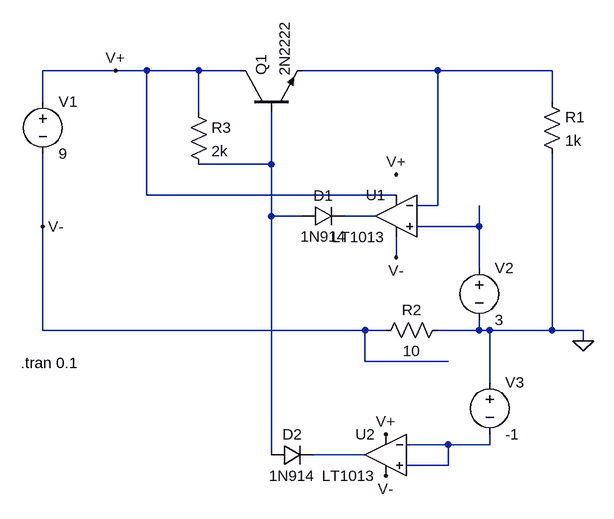
[diagram p0: schematic Draft10.asc]
Draft10.asc, the LTspice schematic file:
Version 4
SHEET 1 880 696
WIRE -144 0 -256 0
WIRE -96 0 -144 0
WIRE -16 0 -96 0
WIRE 48 0 -16 0
WIRE 352 0 144 0
WIRE 528 0 352 0
WIRE -256 48 -256 0
WIRE 528 48 528 0
WIRE -16 64 -16 0
WIRE 96 144 96 64
WIRE 96 144 -16 144
WIRE -96 192 -96 0
WIRE 288 192 -96 192
WIRE 352 208 352 0
WIRE 352 208 320 208
WIRE 96 224 96 144
WIRE 144 224 96 224
WIRE 256 224 208 224
WIRE -256 240 -256 128
WIRE 416 240 416 208
WIRE 416 240 320 240
WIRE 288 288 288 256
WIRE 416 304 416 240
WIRE -256 400 -256 240
WIRE 240 400 -256 400
WIRE 272 400 240 400
WIRE 416 400 416 384
WIRE 416 400 352 400
WIRE 432 400 416 400
WIRE 528 400 528 128
WIRE 528 400 432 400
WIRE 576 400 528 400
WIRE 576 416 576 400
WIRE 240 448 240 400
WIRE 368 448 240 448
WIRE 432 480 432 400
WIRE 368 576 304 576
WIRE 432 576 432 560
WIRE 432 576 368 576
WIRE 96 592 96 224
WIRE 240 592 160 592
WIRE 368 608 368 576
WIRE 368 608 304 608
FLAG 576 416 0
FLAG -144 0 V+
FLAG 288 160 V+
FLAG -256 240 V-
FLAG 272 560 V+
FLAG 288 288 V-
FLAG 272 624 V-
SYMBOL voltage -256 32 R0
WINDOW 123 0 0 Left 0
WINDOW 39 0 0 Left 0
SYMATTR InstName V1
SYMATTR Value 9
SYMBOL res 512 32 R0
SYMATTR InstName R1
SYMATTR Value 1k
SYMBOL res 368 384 R90
WINDOW 0 0 56 VBottom 2
WINDOW 3 32 56 VTop 2
SYMATTR InstName R2
SYMATTR Value 10
SYMBOL Opamps\\LT1013 288 160 M0
SYMATTR InstName U1
SYMBOL diode 144 240 R270
WINDOW 0 32 32 VTop 2
WINDOW 3 0 32 VBottom 2
SYMATTR InstName D1
SYMATTR Value 1N914
SYMBOL voltage 416 288 R0
WINDOW 123 0 0 Left 0
WINDOW 39 0 0 Left 0
SYMATTR InstName V2
SYMATTR Value 3
SYMBOL Opamps\\LT1013 272 528 M0
SYMATTR InstName U2
SYMBOL diode 96 608 R270
WINDOW 0 32 32 VTop 2
WINDOW 3 0 32 VBottom 2
SYMATTR InstName D2
SYMATTR Value 1N914
SYMBOL voltage 432 464 R0
WINDOW 123 0 0 Left 0
WINDOW 39 0 0 Left 0
SYMATTR InstName V3
SYMATTR Value -1
SYMBOL npn 48 64 R270
SYMATTR InstName Q1
SYMATTR Value 2N2222
SYMBOL res -32 48 R0
SYMATTR InstName R3
SYMATTR Value 2k
TEXT -290 450 Left 2 !.tran 0.1

The netlist it stands for:
* Draft10.asc
V1 V+ V- 9
R1 N001 0 1k
R2 0 V- 10
XU1 N004 N001 V+ V- N003 LT1013  ; pins In+ In- V+ V- OUT
D1 N002 N003 1N914
V2 N004 0 3
XU2 N005 N005 V+ V- N006 LT1013  ; pins In+ In- V+ V- OUT
D2 N002 N006 1N914
V3 0 N005 -1
Q1 V+ N002 N001 0 2N2222
R3 V+ N002 2k
.model D D
.lib standard.dio
.model NPN NPN
.model PNP PNP
.lib standard.bjt
.tran 0.1
.lib LTC.lib
.backanno
.end